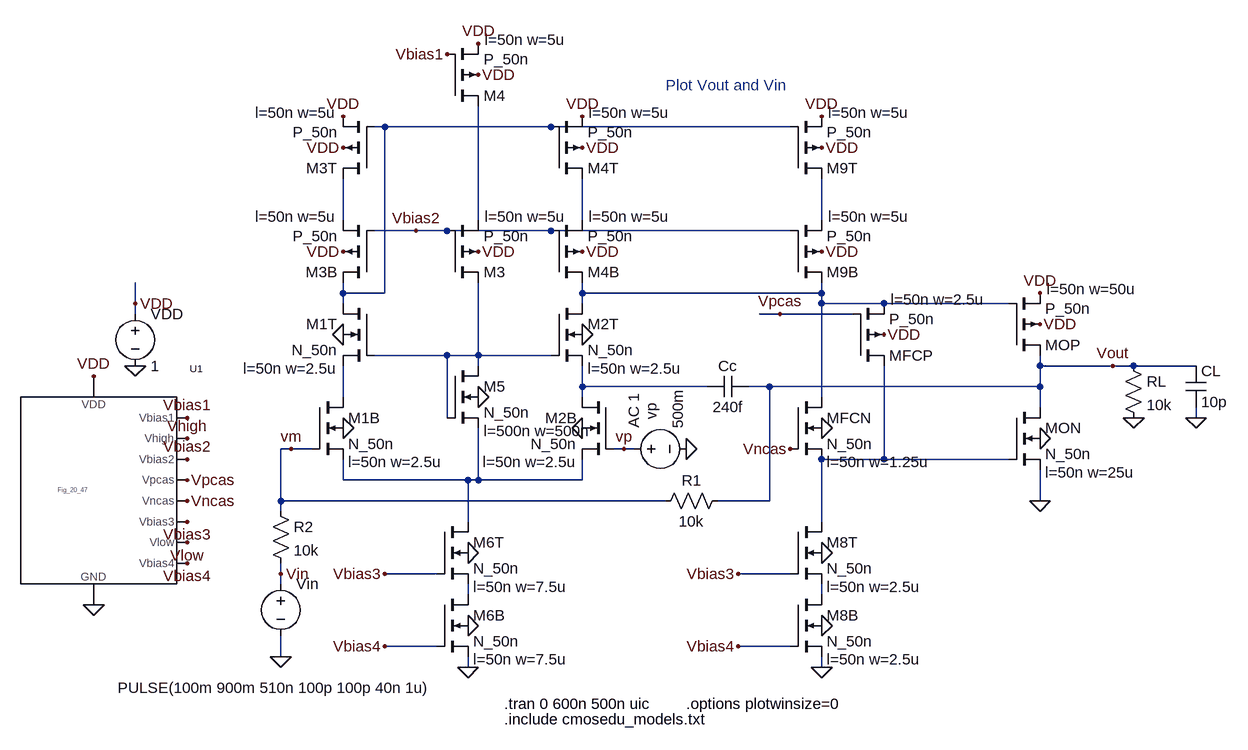
[diagram p0: schematic Fig24_32.asc]
Fig24_32.asc, the LTspice schematic file:
Version 4
SHEET 1 2584 680
WIRE 1248 -624 1232 -624
WIRE 1504 -624 1248 -624
WIRE 1872 -624 1504 -624
WIRE 1184 -480 1184 -544
WIRE 1392 -480 1392 -656
WIRE 1552 -480 1552 -544
WIRE 1920 -480 1920 -544
WIRE 1296 -464 1232 -464
WIRE 1344 -464 1296 -464
WIRE 1504 -464 1344 -464
WIRE 1872 -464 1504 -464
WIRE 1184 -368 1184 -384
WIRE 1248 -368 1248 -624
WIRE 1248 -368 1184 -368
WIRE 1552 -368 1552 -384
WIRE 1920 -368 1920 -384
WIRE 1920 -368 1552 -368
WIRE 864 -352 864 -384
WIRE 1184 -352 1184 -368
WIRE 1552 -352 1552 -368
WIRE 1920 -352 1920 -368
WIRE 2016 -352 1920 -352
WIRE 2208 -352 2016 -352
WIRE 864 -336 864 -352
WIRE 1856 -336 1824 -336
WIRE 1968 -336 1856 -336
WIRE 1344 -272 1232 -272
WIRE 1392 -272 1392 -384
WIRE 1392 -272 1344 -272
WIRE 1504 -272 1392 -272
WIRE 1392 -256 1392 -272
WIRE 2256 -256 2256 -272
WIRE 2368 -256 2256 -256
WIRE 2400 -256 2368 -256
WIRE 2496 -256 2400 -256
WIRE 1552 -224 1552 -256
WIRE 1744 -224 1552 -224
WIRE 1840 -224 1808 -224
WIRE 2256 -224 2256 -256
WIRE 2256 -224 1840 -224
WIRE 1184 -208 1184 -256
WIRE 1552 -208 1552 -224
WIRE 1920 -208 1920 -352
WIRE 2256 -192 2256 -224
WIRE 1344 -176 1344 -272
WIRE 2496 -176 2496 -192
WIRE 1104 -128 1088 -128
WIRE 1136 -128 1104 -128
WIRE 1616 -128 1600 -128
WIRE 1632 -128 1616 -128
WIRE 1920 -112 1920 -128
WIRE 2016 -112 2016 -256
WIRE 2016 -112 1920 -112
WIRE 2208 -112 2016 -112
WIRE 1184 -80 1184 -112
WIRE 1376 -80 1184 -80
WIRE 1392 -80 1392 -160
WIRE 1392 -80 1376 -80
WIRE 1552 -80 1552 -112
WIRE 1552 -80 1392 -80
WIRE 1088 -48 1088 -128
WIRE 1680 -48 1088 -48
WIRE 1840 -48 1840 -224
WIRE 1840 -48 1760 -48
WIRE 2256 -48 2256 -96
WIRE 1088 -32 1088 -48
WIRE 1376 -16 1376 -80
WIRE 1920 -16 1920 -112
WIRE 1088 64 1088 48
WIRE 1328 64 1248 64
WIRE 1872 64 1792 64
WIRE 1088 80 1088 64
WIRE 1376 96 1376 80
WIRE 1920 96 1920 80
WIRE 1328 176 1248 176
WIRE 1872 176 1792 176
WIRE 1088 192 1088 160
WIRE 1376 208 1376 192
WIRE 1920 208 1920 192
FLAG 864 -256 0
FLAG 864 -352 VDD
FLAG 1552 -160 0
FLAG 1376 208 0
FLAG 1184 -160 0
FLAG 1552 -640 VDD
FLAG 1552 -592 VDD
FLAG 1184 -592 VDD
FLAG 800 -240 VDD
FLAG 800 112 0
FLAG 944 -176 Vbias1
FLAG 944 -144 Vhigh
FLAG 944 -112 Vbias2
FLAG 944 -16 Vbias3
FLAG 944 -80 Vpcas
FLAG 944 -48 Vncas
FLAG 944 48 Vbias4
FLAG 944 16 Vlow
FLAG 1184 -640 VDD
FLAG 1376 32 0
FLAG 1376 144 0
FLAG 1248 64 Vbias3
FLAG 1248 176 Vbias4
FLAG 1712 -128 0
FLAG 1104 -128 vm
FLAG 1616 -128 vp
FLAG 1920 -432 VDD
FLAG 1920 208 0
FLAG 1920 32 0
FLAG 1920 144 0
FLAG 1792 64 Vbias3
FLAG 1792 176 Vbias4
FLAG 1552 -432 VDD
FLAG 1184 -432 VDD
FLAG 1920 -640 VDD
FLAG 1920 -592 VDD
FLAG 1296 -464 Vbias2
FLAG 1552 -304 0
FLAG 1184 -304 0
FLAG 1392 -432 VDD
FLAG 1392 -752 VDD
FLAG 1392 -704 VDD
FLAG 1344 -736 Vbias1
FLAG 1392 -208 0
FLAG 2016 -304 VDD
FLAG 1856 -336 Vpcas
FLAG 1920 -160 0
FLAG 1872 -128 Vncas
FLAG 2256 -320 VDD
FLAG 2256 -144 0
FLAG 2256 -48 0
FLAG 2256 -368 VDD
FLAG 2368 -256 Vout
FLAG 1088 192 0
FLAG 2400 -176 0
FLAG 2496 -176 0
FLAG 1088 64 Vin
SYMBOL voltage 864 -352 R0
WINDOW 123 0 0 Left 2
WINDOW 39 0 0 Left 2
SYMATTR InstName VDD
SYMATTR Value 1
SYMBOL nmos4 1600 -208 M0
WINDOW 123 56 100 Left 2
SYMATTR Value2 l=50n w=2.5u
SYMATTR InstName M2B
SYMATTR Value N_50n
SYMBOL nmos4 1136 -208 R0
WINDOW 123 56 100 Left 2
SYMATTR Value2 l=50n w=2.5u
SYMATTR InstName M1B
SYMATTR Value N_50n
SYMBOL pmos4 1504 -544 M180
WINDOW 123 58 102 Left 2
WINDOW 0 56 16 Left 2
SYMATTR Value2 l=50n w=5u
SYMATTR InstName M4T
SYMATTR Value P_50n
SYMBOL pmos4 1232 -544 R180
WINDOW 123 58 102 Left 2
WINDOW 0 56 16 Left 2
SYMATTR Value2 l=50n w=5u
SYMATTR InstName M3T
SYMATTR Value P_50n
SYMBOL Fig_20_47 800 -64 R0
SYMATTR InstName U1
SYMBOL nmos4 1328 -16 R0
WINDOW 123 56 100 Left 2
SYMATTR Value2 l=50n w=7.5u
SYMATTR InstName M6T
SYMATTR Value N_50n
SYMBOL nmos4 1328 96 R0
WINDOW 123 56 100 Left 2
SYMATTR Value2 l=50n w=7.5u
SYMATTR InstName M6B
SYMATTR Value N_50n
SYMBOL voltage 1616 -128 R270
WINDOW 0 45 42 Left 2
WINDOW 3 31 83 Left 2
WINDOW 39 0 0 Left 2
WINDOW 123 32 15 Left 2
SYMATTR InstName vp
SYMATTR Value 500m
SYMATTR Value2 AC 1
SYMBOL pmos4 1872 -384 M180
WINDOW 123 58 102 Left 2
WINDOW 0 56 16 Left 2
SYMATTR Value2 l=50n w=5u
SYMATTR InstName M9B
SYMATTR Value P_50n
SYMBOL nmos4 1872 -16 R0
WINDOW 123 56 100 Left 2
SYMATTR Value2 l=50n w=2.5u
SYMATTR InstName M8T
SYMATTR Value N_50n
SYMBOL nmos4 1872 96 R0
WINDOW 123 56 100 Left 2
SYMATTR Value2 l=50n w=2.5u
SYMATTR InstName M8B
SYMATTR Value N_50n
SYMBOL cap 1808 -240 R90
WINDOW 0 0 32 VBottom 2
WINDOW 3 32 32 VTop 2
SYMATTR InstName Cc
SYMATTR Value 240f
SYMBOL pmos4 1504 -384 M180
WINDOW 123 58 102 Left 2
WINDOW 0 56 16 Left 2
SYMATTR Value2 l=50n w=5u
SYMATTR InstName M4B
SYMATTR Value P_50n
SYMBOL pmos4 1232 -384 R180
WINDOW 123 58 102 Left 2
WINDOW 0 56 16 Left 2
SYMATTR Value2 l=50n w=5u
SYMATTR InstName M3B
SYMATTR Value P_50n
SYMBOL pmos4 1872 -544 M180
WINDOW 123 58 102 Left 2
WINDOW 0 56 16 Left 2
SYMATTR Value2 l=50n w=5u
SYMATTR InstName M9T
SYMATTR Value P_50n
SYMBOL nmos4 1504 -352 R0
WINDOW 123 56 100 Left 2
SYMATTR Value2 l=50n w=2.5u
SYMATTR InstName M2T
SYMATTR Value N_50n
SYMBOL nmos4 1232 -352 M0
WINDOW 123 56 100 Left 2
SYMATTR Value2 l=50n w=2.5u
SYMATTR InstName M1T
SYMATTR Value N_50n
SYMBOL pmos4 1344 -384 M180
WINDOW 123 58 102 Left 2
WINDOW 0 56 16 Left 2
SYMATTR Value2 l=50n w=5u
SYMATTR InstName M3
SYMATTR Value P_50n
SYMBOL pmos4 1344 -656 M180
WINDOW 123 58 102 Left 2
WINDOW 0 56 16 Left 2
SYMATTR Value2 l=50n w=5u
SYMATTR InstName M4
SYMATTR Value P_50n
SYMBOL nmos4 1344 -256 R0
WINDOW 123 56 100 Left 2
SYMATTR Value2 l=500n w=500n
SYMATTR InstName M5
SYMATTR Value N_50n
SYMBOL pmos4 1968 -256 M180
WINDOW 123 58 102 Left 2
WINDOW 0 56 16 Left 2
SYMATTR Value2 l=50n w=2.5u
SYMATTR InstName MFCP
SYMATTR Value P_50n
SYMBOL nmos4 1872 -208 R0
WINDOW 123 56 100 Left 2
SYMATTR Value2 l=50n w=1.25u
SYMATTR InstName MFCN
SYMATTR Value N_50n
SYMBOL pmos4 2208 -272 M180
WINDOW 123 58 102 Left 2
WINDOW 0 56 16 Left 2
SYMATTR Value2 l=50n w=50u
SYMATTR InstName MOP
SYMATTR Value P_50n
SYMBOL nmos4 2208 -192 R0
WINDOW 123 56 100 Left 2
SYMATTR Value2 l=50n w=25u
SYMATTR InstName MON
SYMATTR Value N_50n
SYMBOL res 1664 -32 R270
WINDOW 0 32 56 VTop 2
WINDOW 3 0 56 VBottom 2
SYMATTR InstName R1
SYMATTR Value 10k
SYMBOL res 1072 -48 R0
SYMATTR InstName R2
SYMATTR Value 10k
SYMBOL voltage 1088 64 R0
WINDOW 3 -251 176 Left 2
WINDOW 123 0 0 Left 2
WINDOW 39 0 0 Left 2
SYMATTR Value PULSE(100m 900m 510n 100p 100p 40n 1u)
SYMATTR InstName Vin
SYMBOL res 2384 -272 R0
SYMATTR InstName RL
SYMATTR Value 10k
SYMBOL cap 2480 -256 R0
SYMATTR InstName CL
SYMATTR Value 10p
TEXT 1432 288 Left 2 !.include cmosedu_models.txt
TEXT 1680 -688 Left 2 ;Plot Vout and Vin
TEXT 1432 264 Left 2 !.tran 0 600n 500n uic
TEXT 1712 264 Left 2 !.options plotwinsize=0

The netlist it stands for:
* Fig24_32.asc
VDD VDD 0 1
M2B N008 vp N011 0 N_50n l=50n w=2.5u
M1B N009 vm N011 0 N_50n l=50n w=2.5u
M4T N004 N001 VDD VDD P_50n l=50n w=5u
M3T N002 N001 VDD VDD P_50n l=50n w=5u
XU1 Vbias1 Vhigh Vbias2 Vpcas Vncas Vbias3 Vlow Vbias4 VDD 0 Fig_20_47  ; pins Vbias1 Vhigh Vbias2 Vpcas Vncas Vbias3 Vlow Vbias4 VDD GND
M6T N011 Vbias3 N012 0 N_50n l=50n w=7.5u
M6B N012 Vbias4 0 0 N_50n l=50n w=7.5u
vp vp 0 500m AC 1
M9B N006 Vbias2 N005 VDD P_50n l=50n w=5u
M8T N010 Vbias3 N013 0 N_50n l=50n w=2.5u
M8B N013 Vbias4 0 0 N_50n l=50n w=2.5u
Cc Vout N008 240f
M4B N006 Vbias2 N004 VDD P_50n l=50n w=5u
M3B N001 Vbias2 N002 VDD P_50n l=50n w=5u
M9T N005 N001 VDD VDD P_50n l=50n w=5u
M2T N006 N007 N008 0 N_50n l=50n w=2.5u
M1T N001 N007 N009 0 N_50n l=50n w=2.5u
M3 N007 Vbias2 N003 VDD P_50n l=50n w=5u
M4 N003 Vbias1 VDD VDD P_50n l=50n w=5u
M5 N007 N007 N011 0 N_50n l=500n w=500n
MFCP N010 Vpcas N006 VDD P_50n l=50n w=2.5u
MFCN N006 Vncas N010 0 N_50n l=50n w=1.25u
MOP Vout N006 VDD VDD P_50n l=50n w=50u
MON Vout N010 0 0 N_50n l=50n w=25u
R1 vm Vout 10k
R2 vm Vin 10k
Vin Vin 0 PULSE(100m 900m 510n 100p 100p 40n 1u)
RL Vout 0 10k
CL Vout 0 10p
.model NMOS NMOS
.model PMOS PMOS
.lib standard.mos
.include cmosedu_models.txt
* Plot Vout and Vin
.tran 0 600n 500n uic
.options plotwinsize=0
.backanno
.end